# EAGLE design WilamowskiPI (EAGLE 9.6.2)
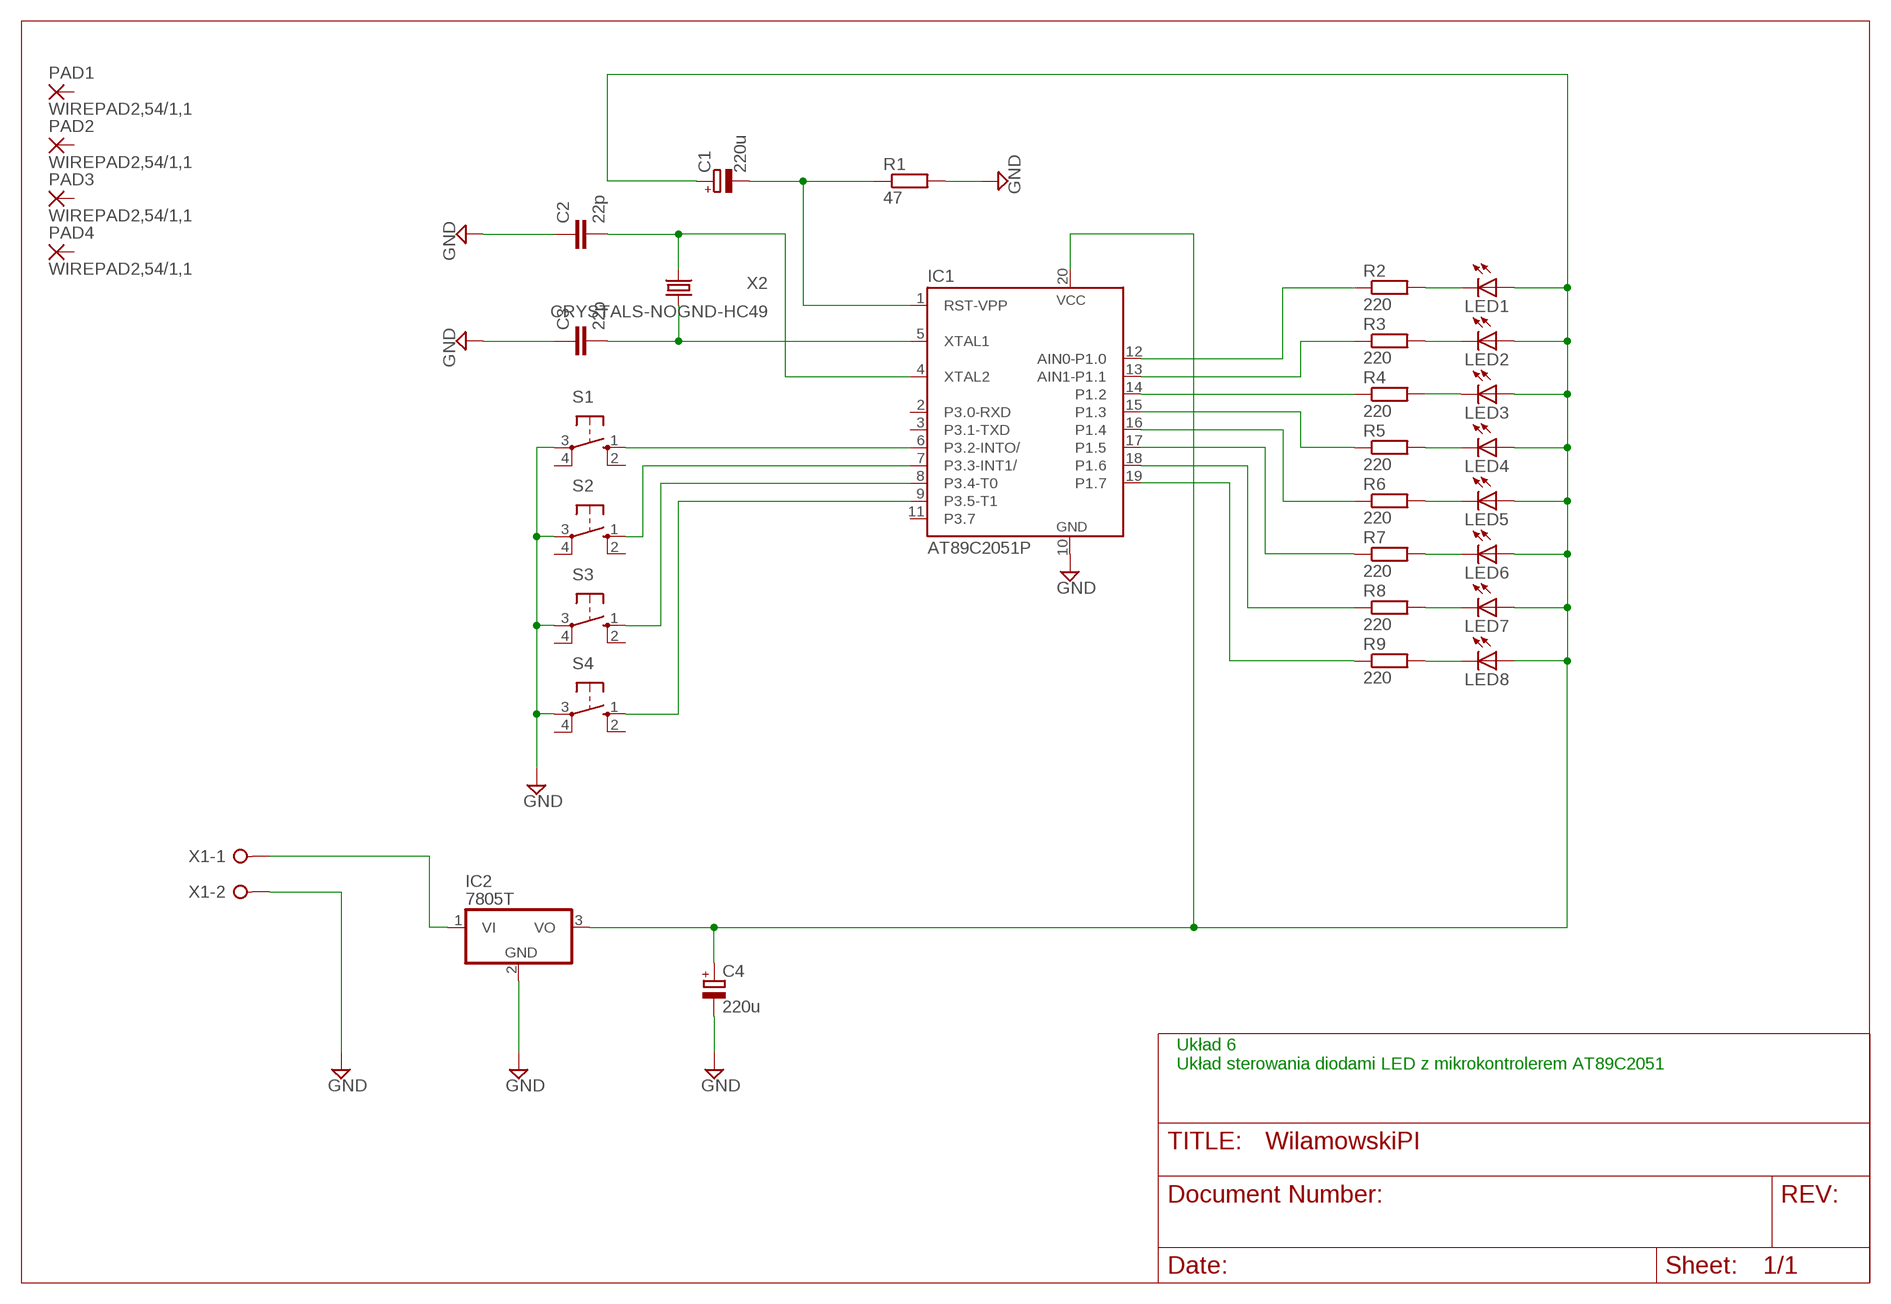
[diagram p0: schematic, sheet 1]

## Parts
C1  220u  CPOL-EUE3.5-8  [E3,5-8]
C2  22p  C-EUC1206  [C1206]
C3  22p  C-EUC1206  [C1206]
C4  220u  CPOL-EUE3.5-8  [E3,5-8]
IC1  AT89C2051P  [DIL20]
IC2  7805T  [TO220H]
LED1  LED3MM  [LED3MM]
LED2  LED3MM  [LED3MM]
LED3  LED3MM  [LED3MM]
LED4  LED3MM  [LED3MM]
LED5  LED3MM  [LED3MM]
LED6  LED3MM  [LED3MM]
LED7  LED3MM  [LED3MM]
LED8  LED3MM  [LED3MM]
PAD1  WIREPAD2,54/1,1  [2,54/1,1]
PAD2  WIREPAD2,54/1,1  [2,54/1,1]
PAD3  WIREPAD2,54/1,1  [2,54/1,1]
PAD4  WIREPAD2,54/1,1  [2,54/1,1]
R1  47  R-EU_R1206  [R1206]
R2  220  R-EU_R1206  [R1206]
R3  220  R-EU_R1206  [R1206]
R4  220  R-EU_R1206  [R1206]
R5  220  R-EU_R1206  [R1206]
R6  220  R-EU_R1206  [R1206]
R7  220  R-EU_R1206  [R1206]
R8  220  R-EU_R1206  [R1206]
R9  220  R-EU_R1206  [R1206]
S1  10-XX  [B3F-10XX]
S2  10-XX  [B3F-10XX]
S3  10-XX  [B3F-10XX]
S4  10-XX  [B3F-10XX]
X1  W237-02P  [W237-132]
X2  CRYSTALS-NOGND-HC49  [HC49]

## Nets
GND: C2.1 C3.1 C4.- IC1.10(GND) IC2.2(GND) R1.2 S1.3(P) S2.3(P) S3.3(P) S4.3(P) X1.2
N$1: C1.- IC1.1(RST-VPP) R1.1
N$2: C2.2 IC1.4(XTAL2) X2.2
N$3: C3.2 IC1.5(XTAL1) X2.1
N$4: IC1.9(P3.5-T1) S4.1(S)
N$5: IC1.6(P3.2-INTO/) S1.1(S)
N$6: IC1.7(P3.3-INT1/) S2.1(S)
N$7: IC1.8(P3.4-T0) S3.1(S)
N$8: IC1.12(AIN0-P1.0) R2.1
N$9: IC1.13(AIN1-P1.1) R3.1
N$10: IC1.14(P1.2) R4.1
N$11: IC1.15(P1.3) R5.1
N$12: IC1.16(P1.4) R6.1
N$13: IC1.17(P1.5) R7.1
N$14: IC1.18(P1.6) R8.1
N$15: IC1.19(P1.7) R9.1
N$16: C1.+ C4.+ IC1.20(VCC) IC2.3(VO) LED1.A LED2.A LED3.A LED4.A LED5.A LED6.A LED7.A LED8.A
N$17: LED1.K(C) R2.2
N$18: LED2.K(C) R3.2
N$19: LED3.K(C) R4.2
N$20: LED4.K(C) R5.2
N$21: LED5.K(C) R6.2
N$22: LED6.K(C) R7.2
N$23: LED7.K(C) R8.2
N$24: LED8.K(C) R9.2
N$27: IC2.1(VI) X1.1
Unconnected: IC1.2(P3.0-RXD) IC1.3(P3.1-TXD) IC1.11(P3.7) PAD1.1(P) PAD2.1(P) PAD3.1(P) PAD4.1(P) S1.2(S1) S1.4(P1) S2.2(S1) S2.4(P1) S3.2(S1) S3.4(P1) S4.2(S1) S4.4(P1)

## Notes on the sheet
- Układ 6
  Układ sterowania diodami LED z mikrokontrolerem AT89C2051

## Library data of the parts
C1 C4 = rcl:CPOL-EU: POLARIZED CAPACITOR, European symbol
C2 C3 = rcl:C-EU: CAPACITOR, European symbol
IC1 = atmel:AT89C2051: 80C31 MICROCONTROLLER 2 Kbytes FLASH 2.7 V; MPN: AT89C2051-12PU; OC_FARNELL: 1699389; OC_NEWARK: 80P3687
IC2 = linear:78*: Positive VOLTAGE REGULATOR Source: http://cache.national.com/ds/LM/LM78L05.pdf http://www.fairchildsemi.com/ds/LM/LM7805.pdf
LED1-LED8 = led:LED: LED OSRAM: - CHIPLED LG R971, LG N971, LY N971, LG Q971, LY Q971, LO R971, LY R971 LH N974, LH R974 LS Q976, LO Q976, LY Q976 LO Q996 - Hyper CHIPLED LW Q18S LB Q993, LB Q99A, LB R99A - SideLED LS A670, LO A670, LY A670, LG A670, LP A670 LB A673, LV A673, LT A673, LW A673 LH A674 LY A675 LS A676, LA A676, LO A676, LY A676, LW A676 LS A679, LY A679, LG A679 - Hyper Micro SIDELED® LS Y876, LA Y876, LO Y876, LY Y876 LT Y87S - SmartLED LW L88C, LW L88S LB L89C, LB L89S, LG L890 LS L89K, LO L89K, LY L89K LS L896, LA L896, LO L896, LY L896 - TOPLED LS T670, LO T670, LY T670, LG T670, LP T670 LSG T670, LSP T670, LSY T670, LOP T670, LYG T670 LG T671, LOG T671, LSG T671 LB T673, LV T673, LT T673, LW T673 LH T674 LS T676, LA T676, LO T676, LY T676, LB T676, LH T676, LSB T676, LW T676 LB T67C, LV T67C, LT T67C, LS T67K, LO T67K, LY T67K, LW E67C LS E67B, LA E67B, LO E67B, LY E67B, LB E67C, LV E67C, LT E67C LW T67C LS T679, LY T679, LG T679 LS T770, LO T770, LY T770, LG T770, LP T770 LB T773, LV T773, LT T773, LW T773 LH T774 LS E675, LA E675, LY E675, LS T675 LS T776, LA T776, LO T776, LY T776, LB T776 LHGB T686 LT T68C, LB T68C - Hyper Mini TOPLED® LB M676 - Mini TOPLED Santana® LG M470 LS M47K, LO M47K, LY M47K Source: http://www.osram.convergy.de LUXEON: - LUMILED® LXK2-PW12-R00, LXK2-PW12-S00, LXK2-PW14-U00, LXK2-PW14-V00 LXK2-PM12-R00, LXK2-PM12-S00, LXK2-PM14-U00 LXK2-PE12-Q00, LXK2-PE12-R00, LXK2-PE12-S00, LXK2-PE14-T00, LXK2-PE14-U00 LXK2-PB12-K00, LXK2-PB12-L00, LXK2-PB12-M00, LXK2-PB14-N00, LXK2-PB14-P00, LXK2-PB14-Q00 LXK2-PR12-L00, LXK2-PR12-M00, LXK2-PR14-Q00, LXK2-PR14-R00 LXK2-PD12-Q00, LXK2-PD12-R00, LXK2-PD12-S00 LXK2-PH12-R00, LXK2-PH12-S00 LXK2-PL12-P00, LXK2-PL12-Q00, LXK2-PL12-R00 Source: www.luxeon.com KINGBRIGHT: KA-3528ASYC Source: www.kingbright.com
PAD1-PAD4 = wirepad:WIREPAD: Wire PAD connect wire on PCB
R1-R9 = rcl:R-EU_: RESISTOR, European symbol
S1-S4 = switch-omron:10-XX: OMRON SWITCH; MPN: B3F-1000; OC_FARNELL: 176432; OC_NEWARK: 36M3542
X1 = con-wago-508:W237-02P: WAGO SREW CLAMP; OC_FARNELL: unknown; OC_NEWARK: unknown
X2 = IQD-Frequency-Products:CRYSTALS-NOGND: CRYSTALS CAN NOT GROUNDED

## Board
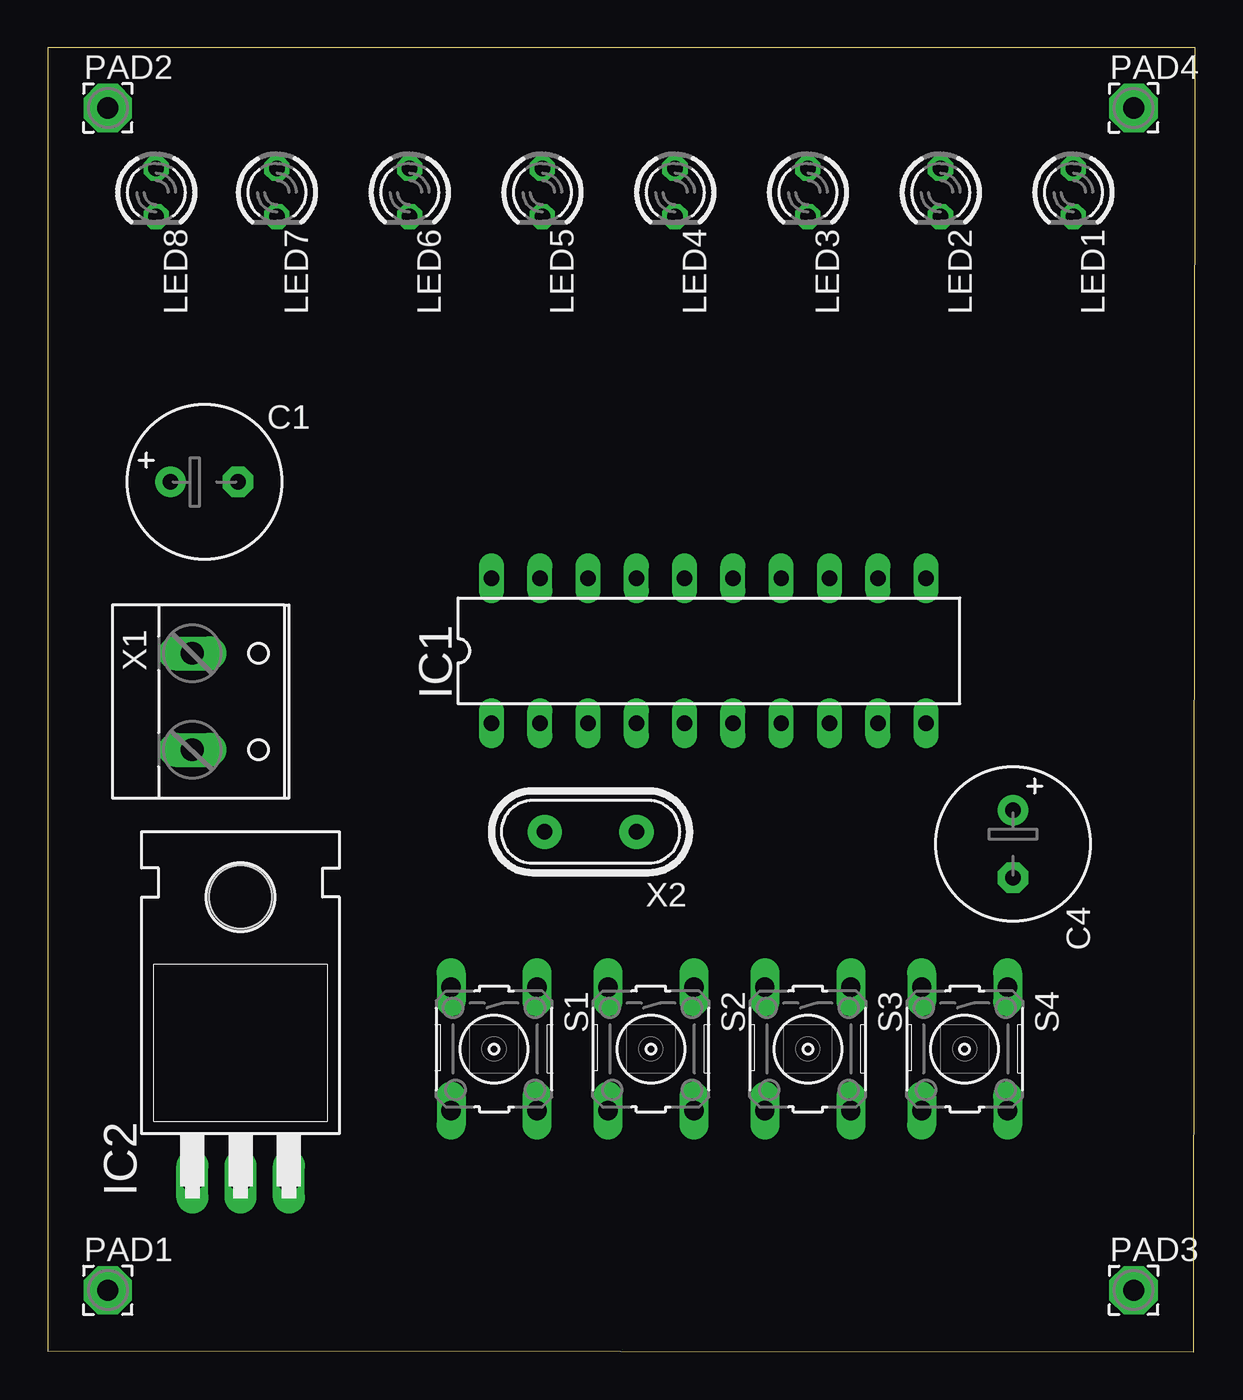
[diagram p1: board, top side]
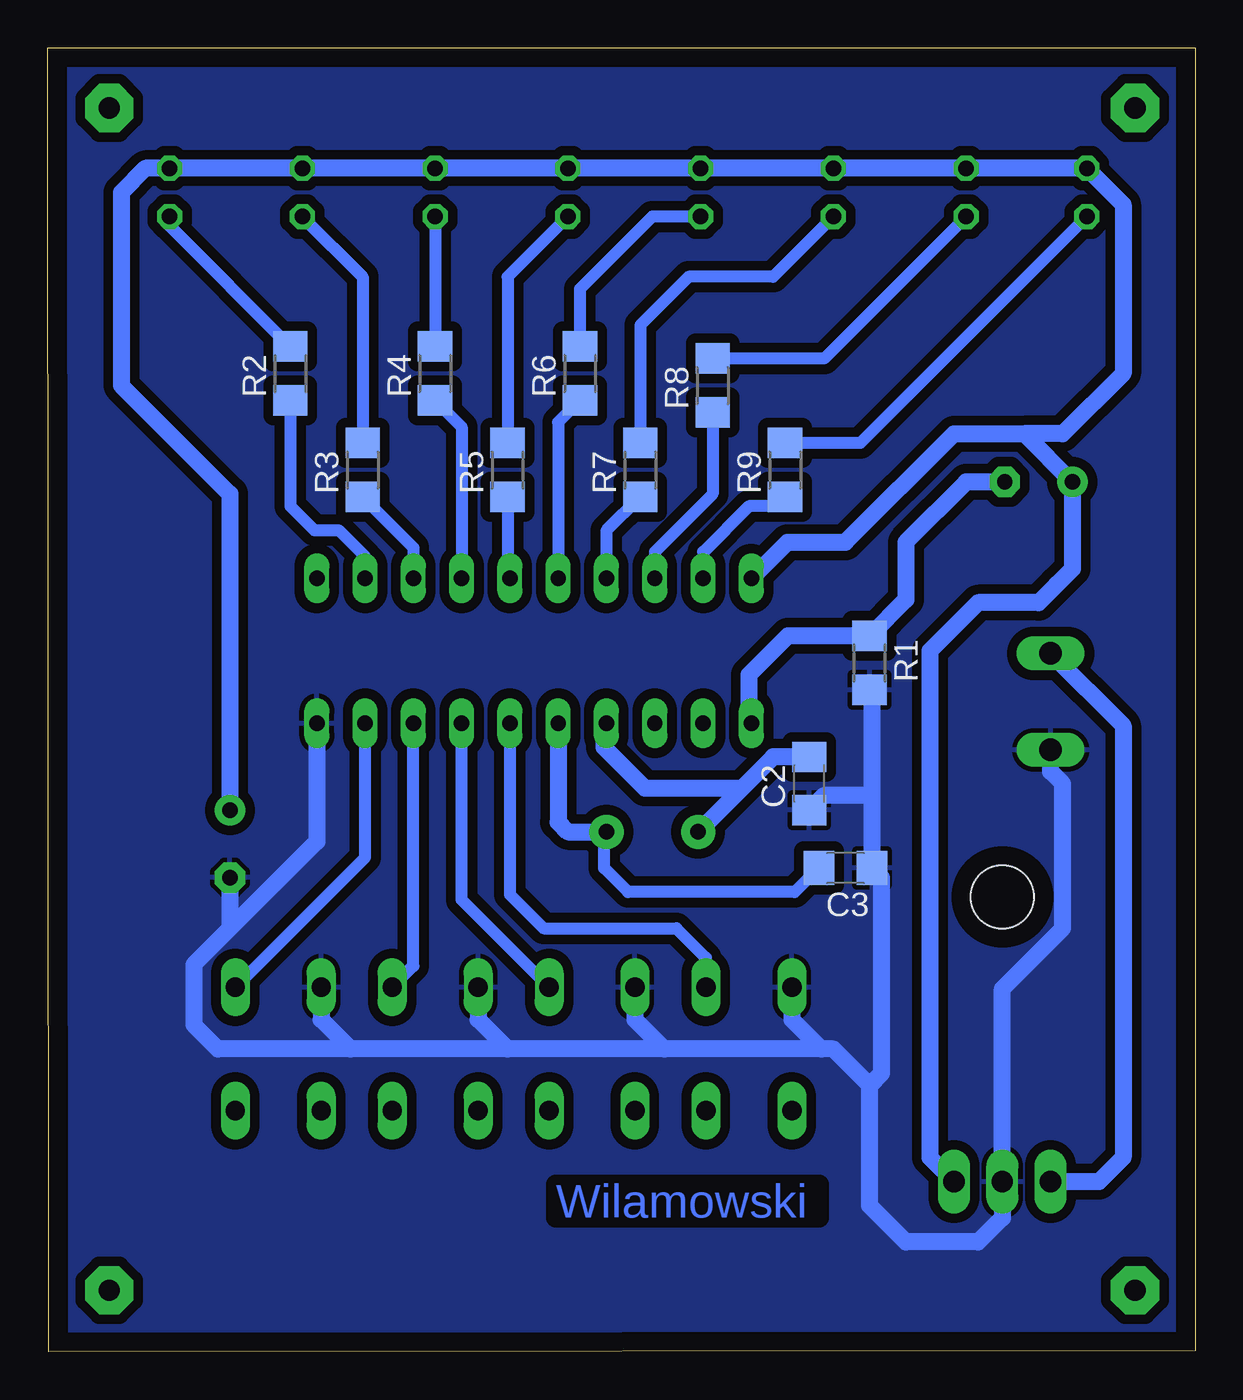
[diagram p2: board, bottom side, seen from below]

Size 60.4 x 68.67 mm. Coordinates in mm from the lower left corner, seen from the top.
Outline: 0,0.08 60.33,0 60.4,68.67 0,68.65 0,0.08
Copper layers (1*16): Top 0.035mm / dielectric 1.5mm / Bottom 0.035mm
Design rules "default *": minimum track width 10mil, minimum drill 24mil, track to track 20mil, track to pad 20mil, pad to pad 20mil, via to via 20mil, smd to smd 20mil, copper to edge 40mil, drill to drill 8mil, minimum pad ring 10mil, minimum via ring 8mil, stop-mask expansion 4mil, vias tented up to drill 0mil, thermal gap 10mil

### Footprints (pad centres in the part's own frame; a part is rotated, then mirrored left to right if it is on the bottom)
E3,5-8 = drill 0.813 pad 1.6: + -1.778,0 | drill 0.813 pad 1.6 octagon: - 1.778,0
C1206 = smd 1.6 x 1.8: 1 -1.4,0; 2 1.4,0
DIL20 = drill 0.813 long: 1 -11.43,-3.81; 2 -8.89,-3.81; 3 -6.35,-3.81; 4 -3.81,-3.81; 5 -1.27,-3.81; 6 1.27,-3.81; 7 3.81,-3.81; 8 6.35,-3.81; 9 8.89,-3.81; 10 11.43,-3.81; 11 11.43,3.81; 12 8.89,3.81; 13 6.35,3.81; 14 3.81,3.81; 15 1.27,3.81; 16 -1.27,3.81; 17 -3.81,3.81; 18 -6.35,3.81; 19 -8.89,3.81; 20 -11.43,3.81
TO220H = drill 1.118 long: 1 -2.54,-10.16; 2 0,-10.16; 3 2.54,-10.16 | hole 3.302: 0,4.826
LED3MM = drill 0.813 octagon: A -1.27,0; K 1.27,0
2,54/1,1 = drill 1.118 pad 2.54 octagon: 1 0,0
R1206 = smd 1.6 x 1.803: 1 -1.422,0; 2 1.422,0
B3F-10XX = drill 1.016 long: 1 -3.251,2.261; 2 3.251,2.261; 3 -3.251,-2.261; 4 3.251,-2.261
W237-132 = drill 1.194 long: 1 -2.54,-0.635; 2 2.54,-0.635
HC49 = drill 0.813 pad 1.8: 1 -2.413,0; 2 2.413,0

### Placement (x,y rotation side)
C1  8.26,45.8 0 top
C2  20.32,29.92 90 bottom
C3  18.41,25.48 180 bottom
C4  50.8,26.75 270 top
IC1  34.8,36.91 0 top
IC2  10.16,19.13 0 top
LED1  53.98,61.04 270 top
LED2  46.99,61.04 270 top
LED3  40.01,61.04 270 top
LED4  33.02,61.04 270 top
LED5  26.04,61.04 270 top
LED6  19.05,61.04 270 top
LED7  12.06,61.04 270 top
LED8  5.71,61.04 270 top
PAD1  3.17,3.25 0 top
PAD2  3.17,65.48 0 top
PAD3  57.15,3.25 0 top
PAD4  57.15,65.48 0 top
R1  17.14,36.27 270 bottom
R2  47.62,51.51 90 bottom
R3  43.82,46.43 90 bottom
R4  40.01,51.51 90 bottom
R5  36.2,46.43 90 bottom
R6  32.39,51.51 90 bottom
R7  29.21,46.43 90 bottom
R8  25.4,50.88 90 bottom
R9  21.59,46.43 90 bottom
S1  23.49,15.95 270 top
S2  31.75,15.95 270 top
S3  40.01,15.95 270 top
S4  48.26,15.95 270 top
X1  8.26,34.24 270 top
X2  28.57,27.38 180 top

### Tracks (layer width: path | path; a pad name or v marks a point on that pad's centre or on a via)
GND
  Bottom 0.889: 17.14,14.05 19.05,15.95 19.68,15.95 | 19.68,15.95 27.94,15.95 | 27.94,15.95 36.2,15.95 | 36.2,15.95 44.45,15.95 | 44.45,15.95 51.44,15.95 52.71,17.22 52.71,20.4 50.8,22.3 | 17.14,14.05 17.14,7.7 15.24,5.79 11.43,5.79 10.16,7.06 IC2.2 10.16,19.13 6.99,22.3 6.99,29.92 7.62,30.56 X1.2 | S1.3 21.23,17.5 19.68,15.95 | S2.3 29.49,17.5 27.94,15.95 | S3.3 37.74,17.5 36.2,15.95 | S4.3 46,17.5 44.45,15.95 | C4.- 50.8,22.3 | IC1.10 46.23,26.87 50.8,22.3 | 17.14,14.05 16.51,14.68 16.51,24.97 C3.1 17.01,29.29 | 17.01,29.29 17.01,34.72 R1.2 | 17.01,29.29 19.55,29.29 C2.1
  pour Bottom (isolate 0.001): 0,68.66 0,0.08 60.33,0.08 60.33,68.66
N$1
  Bottom 0.635: 23.49,32.97 IC1.1
  Bottom 0.889: IC1.1 23.49,33.22 23.49,35.64 21.44,37.69 R1.1 15.24,39.6 15.24,42.62 12.06,45.8 C1.-
N$2
  Bottom 0.889: C2.2 22.22,31.32 23.88,29.67 | 23.88,29.67 X2.2 | 23.88,29.67 28.96,29.67 31.11,31.83 31.11,32.97 IC1.4
N$3
  Bottom 0.635: C3.2 21.08,24.21 29.84,24.21 31.11,25.48 31.11,27.25 X2.1
  Bottom 0.889: IC1.5 33.53,27.89 33.02,27.38 X2.1
N$4
  Bottom 0.635: S4.1 43.69,26.04 IC1.9
N$5
  Bottom 0.635: IC1.6 36.07,24.08 34.29,22.3 27.3,22.3 25.76,20.75 S1.1
N$6
  Bottom 0.635: S2.1 38.61,23.8 IC1.7
N$7
  Bottom 0.635: S3.1 41.15,20.32 IC1.8
N$8
  Bottom 0.635: IC1.12 43.69,41.86 45.09,43.26 46.36,43.26 47.62,44.53 R2.1
N$9
  Bottom 0.635: R3.1 41.15,42.34 IC1.13
N$10
  Bottom 0.635: R4.1 38.61,48.69 IC1.14
N$11
  Bottom 0.635: R5.1 36.2,40.84 IC1.15
N$12
  Bottom 0.635: R6.1 33.53,48.95 IC1.16
N$13
  Bottom 0.635: R7.1 30.99,43.23 IC1.17
N$14
  Bottom 0.635: R8.1 25.4,45.16 28.45,42.11 IC1.18
N$15
  Bottom 0.635: R9.1 22.07,44.53 23.49,44.53 25.91,42.11 IC1.19
N$16
  Bottom 0.635: 6.35,45.92 C1.+
  Bottom 0.889: C4.+ 50.8,45.16 56.52,50.88 56.52,61.04 55.25,62.31 LED1.A LED2.A LED3.A LED4.A LED5.A LED6.A LED7.A LED8.A 3.81,60.4 3.81,51.51 6.99,48.34 9.02,48.34 | IC1.20 21.46,42.62 18.41,42.62 12.7,48.34 9.02,48.34 | 9.02,48.34 C1.+ 6.48,41.22 7.3,40.4 7.62,40.08 8.26,39.45 11.43,39.45 13.97,36.91 13.97,10.24 IC2.3
N$17
  Bottom 0.635: R2.2 53.98,59.28 LED1.K
N$18
  Bottom 0.635: LED2.K 43.82,56.59 R3.2
N$19
  Bottom 0.635: LED3.K R4.2
N$20
  Bottom 0.635: LED4.K 36.2,56.59 R5.2
N$21
  Bottom 0.635: LED5.K 28.57,59.77 32.39,55.96 R6.2
N$22
  Bottom 0.635: LED6.K 22.22,56.59 26.67,56.59 29.21,54.05 R7.2
N$23
  Bottom 0.635: LED7.K 19.53,52.3 R8.2
N$24
  Bottom 0.635: LED8.K 17.63,47.85 R9.2
N$27
  Bottom 0.889: X1.1 3.81,32.97 3.81,10.24 5.08,8.97 IC2.1

### Text on the board
Bottom: Wilamowski